# EAGLE design W681X (EAGLE 6.6.0)
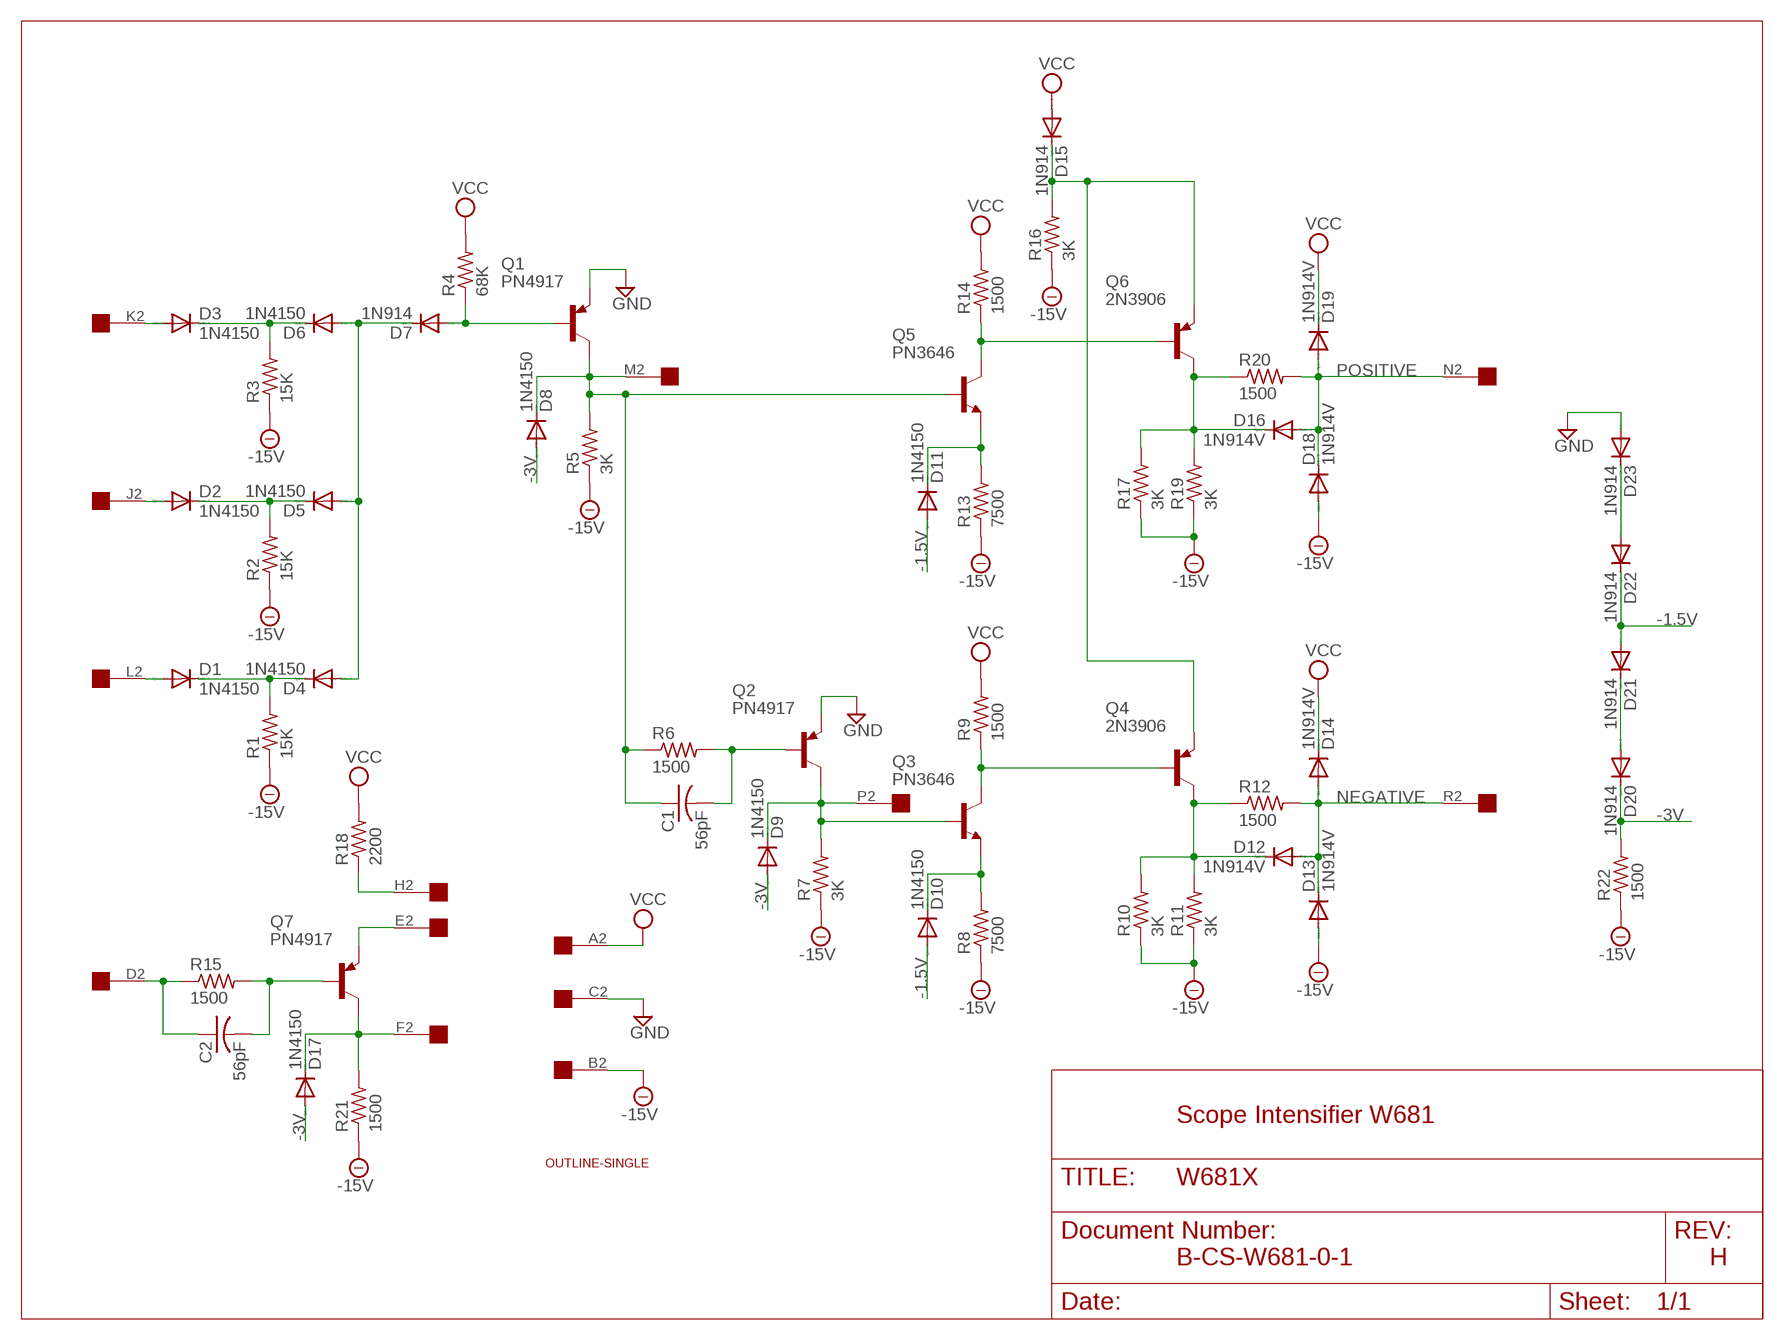
[diagram p0: schematic, sheet 1]

## Parts
C1  56pF  C-US  [C063-025X075]
C2  56pF  C-US  [C063-025X075]
D1  1N4150  DIODE-DO35-10  [DO35-10]
D2  1N4150  DIODE-DO35-10  [DO35-10]
D3  1N4150  DIODE-DO35-10  [DO35-10]
D4  1N4150  DIODE-DO35-10  [DO35-10]
D5  1N4150  DIODE-DO35-10  [DO35-10]
D6  1N4150  DIODE-DO35-10  [DO35-10]
D7  1N914  DIODE-DO35-10  [DO35-10]
D8  1N4150  DIODE-DO35-10  [DO35-10]
D9  1N4150  DIODE-DO35-10  [DO35-10]
D10  1N4150  DIODE-DO35-10  [DO35-10]
D11  1N4150  DIODE-DO35-10  [DO35-10]
D12  1N914V  DIODE-DO35-10  [DO35-10]
D13  1N914V  DIODE-DO35-10  [DO35-10]
D14  1N914V  DIODE-DO35-10  [DO35-10]
D15  1N914  DIODE-DO35-10  [DO35-10]
D16  1N914V  DIODE-DO35-10  [DO35-10]
D17  1N4150  DIODE-DO35-10  [DO35-10]
D18  1N914V  DIODE-DO35-10  [DO35-10]
D19  1N914V  DIODE-DO35-10  [DO35-10]
D20  1N914  DIODE-DO35-10  [DO35-10]
D21  1N914  DIODE-DO35-10  [DO35-10]
D22  1N914  DIODE-DO35-10  [DO35-10]
D23  1N914  DIODE-DO35-10  [DO35-10]
Q1  PN4917  -PNP-TO5  [TO5]
Q2  PN4917  -PNP-TO5  [TO5]
Q3  PN3646  -NPN-TO5  [TO5]
Q4  2N3906  -PNP-TO5  [TO5]
Q5  PN3646  -NPN-TO5  [TO5]
Q6  2N3906  -PNP-TO5  [TO5]
Q7  PN4917  -PNP-TO5  [TO5]
R1  15K  R-US_0207/10  [0207/10]
R2  15K  R-US_0207/10  [0207/10]
R3  15K  R-US_0207/10  [0207/10]
R4  68K  R-US_0207/10  [0207/10]
R5  3K  R-US_0207/10  [0207/10]
R6  1500  R-US_0207/10  [0207/10]
R7  3K  R-US_0207/10  [0207/10]
R8  7500  R-US_0207/10  [0207/10]
R9  1500  R-US_0207/10  [0207/10]
R10  3K  R-US_0207/10  [0207/10]
R11  3K  R-US_0207/10  [0207/10]
R12  1500  R-US_0207/10  [0207/10]
R13  7500  R-US_0207/10  [0207/10]
R14  1500  R-US_0207/10  [0207/10]
R15  1500  R-US_0207/10  [0207/10]
R16  3K  R-US_0207/10  [0207/10]
R17  3K  R-US_0207/10  [0207/10]
R18  2200  R-US_0207/10  [0207/10]
R19  3K  R-US_0207/10  [0207/10]
R20  1500  R-US_0207/10  [0207/10]
R21  1500  R-US_0207/10  [0207/10]
R22  1500  R-US_0207/10  [0207/10]
U$1  OUTLINE-SINGLE  [SINGLE]
U$2  EDGE-1  [EDGE-CON1]

## Nets
-1.5V [supply]: D10.A D11.A D21.A D22.C
-3V: D8.A D9.A D17.A D20.C R22.2
-15V [supply]: D13.A D18.A R1.1 R2.1 R3.1 R5.1 R7.1 R8.1 R10.1 R11.1 R13.1 R16.1 R17.1 R19.1 R21.1 R22.1 U$2.B2
GND [supply]: D23.A Q1.1(E) Q2.1(E) U$2.C2
N$1: D1.A U$2.L2
N$2: D2.A U$2.J2
N$3: D3.A U$2.K2
N$4: D1.C D4.C R1.2
N$5: D2.C D5.C R2.2
N$6: D3.C D6.C R3.2
N$7: D4.A D5.A D6.A D7.C
N$8: D7.A Q1.2(B) R4.1
N$9: C1.1 D8.C Q1.3(C) Q5.2(B) R5.2 R6.1 U$2.M2
N$10: C1.2 Q2.2(B) R6.2
N$11: D9.C Q2.3(C) Q3.2(B) R7.2 U$2.P2
N$12: Q3.3(C) Q4.2(B) R9.1
N$13: D10.C Q3.1(E) R8.2
N$14: D12.C Q4.3(C) R10.2 R11.2 R12.1
N$15: Q5.3(C) Q6.2(B) R14.1
N$16: D11.C Q5.1(E) R13.2
N$17: D15.C Q4.1(E) Q6.1(E) R16.2
N$18: D16.C Q6.3(C) R17.2 R19.2 R20.1
N$19: C2.1 R15.1 U$2.D2
N$20: C2.2 Q7.2(B) R15.2
N$21: D17.C Q7.3(C) R21.2 U$2.F2
N$22: Q7.1(E) U$2.E2
N$23: R18.1 U$2.H2
N$25: D20.A D21.C
N$26: D22.A D23.C
NEGATIVE: D12.A D13.C D14.A R12.2 U$2.R2
POSITIVE: D16.A D18.C D19.A R20.2 U$2.N2
VCC [supply]: D14.C D15.A D19.C R4.2 R9.2 R14.2 R18.2 U$2.A2
Unconnected: U$2.S2 U$2.T2 U$2.U2 U$2.V2

## Notes on the sheet
- Scope Intensifier W681
- B-CS-W681-0-1 | H

## Library data of the parts
C1 C2 = dec-con:C-US: Capacitors with funky DEC lead spacing.
D1-D23 = diode:DIODE-: DIODE
Q1 Q2 Q4 Q6 Q7 = transistor:*-PNP-: PNP Transistror
Q3 Q5 = transistor:*-NPN-: NPN Transistror BF959 corrected 2008.03.06
R1-R22 = rcl:R-US_: RESISTOR, American symbol
U$1 = dec-con:OUTLINE-*: Board outlines for DEC boards.
U$2 = dec-con:EDGE-1: Single-Sided DEC Edge Connector -- (side 2)

## Net classes
1 supply: width 0.813 mm

## Board
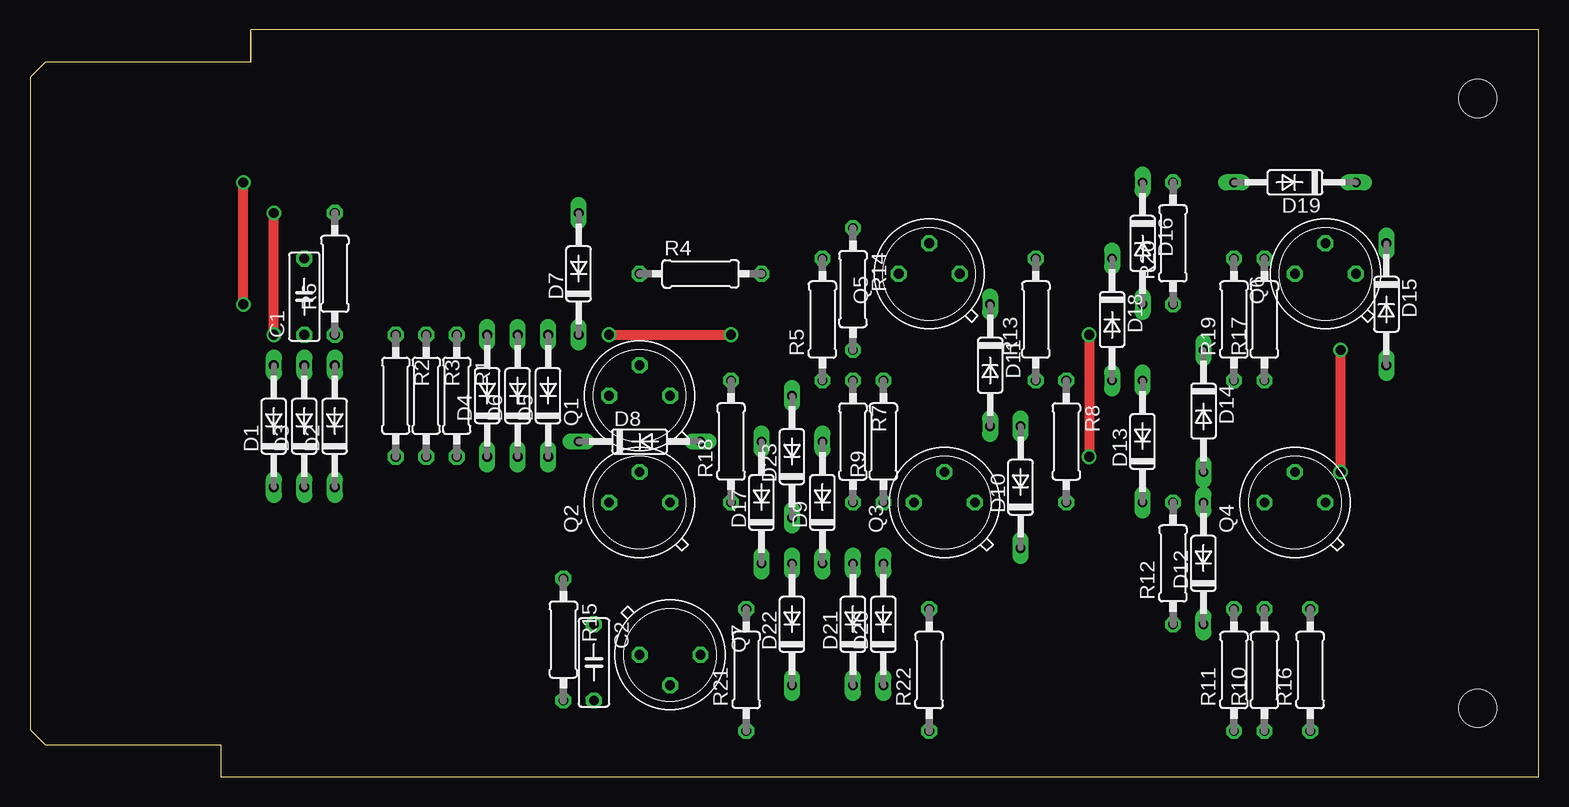
[diagram p1: board, top side]
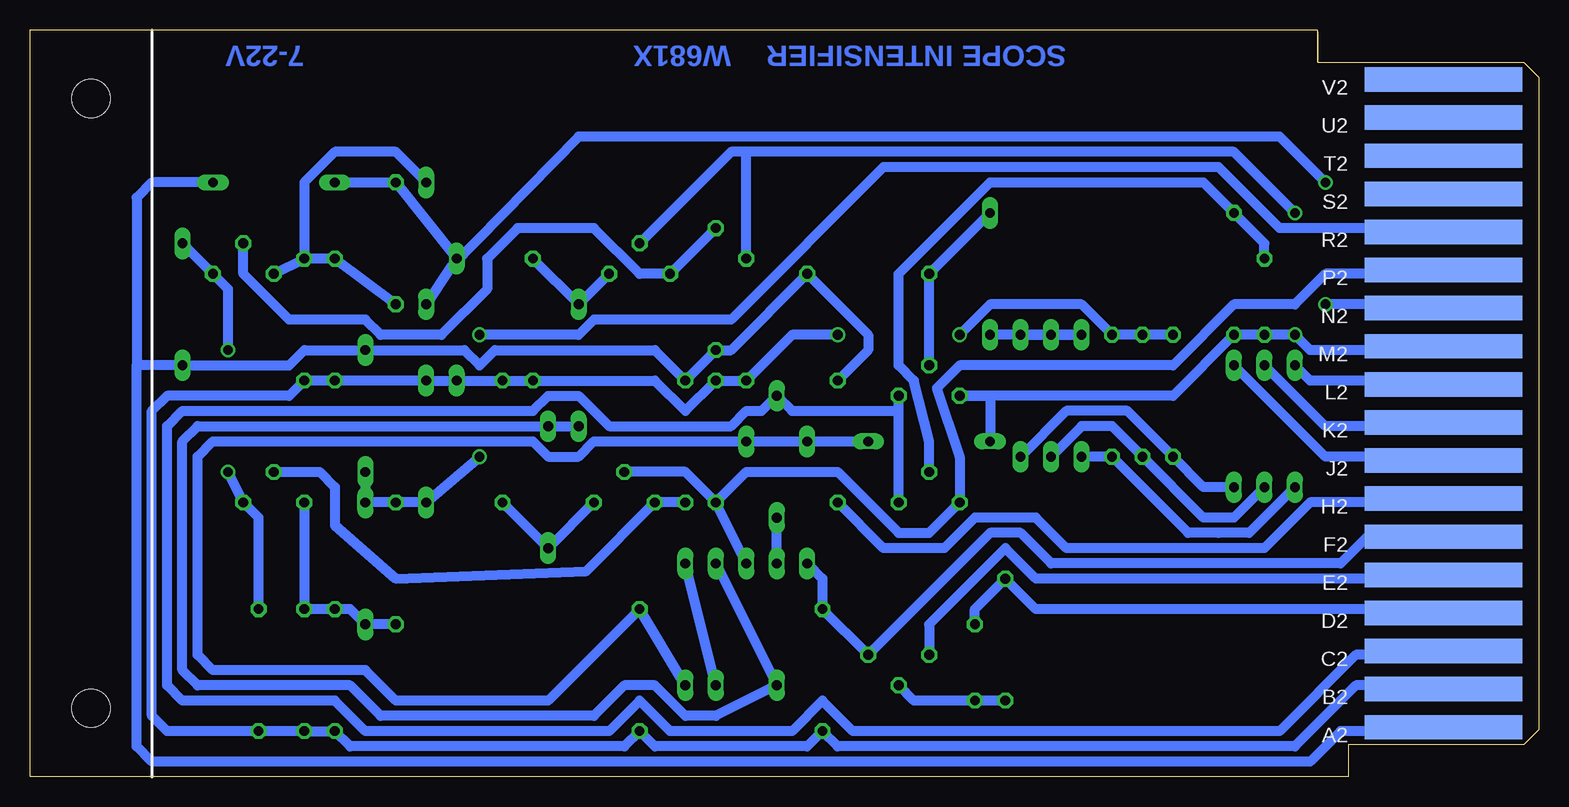
[diagram p2: board, bottom side, seen from below]

Size 125.73 x 62.23 mm. Coordinates in mm from the lower left corner, seen from the top.
Copper layers (1+16): Top 0.035mm / dielectric 1.5mm / Bottom 0.035mm
Design rules "16mils": minimum track width 16mil, minimum drill 32mil, track to track 15mil, track to pad 10mil, pad to pad 10mil, via to via 10mil, smd to smd 10mil, copper to edge 13mil, drill to drill 10mil, minimum pad ring 10mil, minimum via ring 8mil, stop-mask expansion 0mil, vias tented up to drill 0mil, thermal gap 10mil

### Footprints (pad centres in the part's own frame; a part is rotated, then mirrored left to right if it is on the bottom)
C063-025X075 = drill 0.813 octagon: 1 -2.54,0; 2 3.81,0
DO35-10 = drill 0.813 long: A 5.08,0; C -5.08,0
TO5 = drill 0.813 octagon: 1 0,-2.54; 2 2.54,0; 3 0,2.54
0207/10 = drill 0.813 octagon: 1 -5.08,0; 2 5.08,0
SINGLE = hole 3.175: 120.65,56.515; 120.65,5.715
EDGE-CON1 = smd 13.106 x 2.032 bottom: A2 7.938,4.128; B2 7.938,7.303; C2 7.938,10.477; D2 7.938,13.652; E2 7.938,16.828; F2 7.938,20.003; H2 7.938,23.177; J2 7.938,26.352; K2 7.938,29.527; L2 7.938,32.703; M2 7.938,35.877; N2 7.938,39.053; P2 7.938,42.227; R2 7.938,45.403; S2 7.938,48.578; T2 7.938,51.752; U2 7.938,54.928; V2 7.938,58.102

### Placement (x,y rotation side)
C1  22.86,39.37 90 top
C2  46.99,10.16 270 top
D1  20.32,29.21 90 top
D2  25.4,29.21 90 top
D3  22.86,29.21 90 top
D4  38.1,31.75 90 top
D5  43.18,31.75 90 top
D6  40.64,31.75 90 top
D7  45.72,41.91 90 top
D8  50.8,27.94 0 top
D9  66.04,22.86 90 top
D10  82.55,24.13 90 top
D11  80.01,34.29 270 top
D12  97.79,17.78 90 top
D13  92.71,27.94 90 top
D14  97.79,30.48 270 top
D15  113.03,39.37 270 top
D16  92.71,44.45 270 top
D17  60.96,22.86 90 top
D18  90.17,38.1 270 top
D19  105.41,49.53 180 top
D20  71.12,12.7 90 top
D21  68.58,12.7 90 top
D22  63.5,12.7 90 top
D23  63.5,26.67 90 top
Q1  50.8,31.75 90 top
Q2  50.8,22.86 90 top
Q3  76.2,22.86 90 top
Q4  105.41,22.86 90 top
Q5  74.93,41.91 90 top
Q6  107.95,41.91 90 top
Q7  53.34,10.16 270 top
R1  35.56,31.75 270 top
R2  30.48,31.75 270 top
R3  33.02,31.75 270 top
R4  55.88,41.91 0 top
R5  66.04,38.1 90 top
R6  25.4,41.91 90 top
R7  68.58,27.94 270 top
R8  86.36,27.94 270 top
R9  71.12,27.94 90 top
R10  102.87,8.89 90 top
R11  100.33,8.89 90 top
R12  95.25,17.78 90 top
R13  83.82,38.1 90 top
R14  68.58,40.64 270 top
R15  44.45,11.43 270 top
R16  106.68,8.89 90 top
R17  102.87,38.1 90 top
R18  58.42,27.94 90 top
R19  100.33,38.1 90 top
R20  95.25,44.45 90 top
R21  59.69,8.89 90 top
R22  74.93,8.89 90 top
U$1  0,0 0 top
U$2  0,0 0 top

### Tracks (layer width: path | path; a pad name or v marks a point on that pad's centre or on a via)
-1.5V
  Bottom 0.813: D21.A D22.C 68.58,5.08 71.12,5.08 73.66,7.62 76.2,7.62 78.74,5.08 96.52,5.08 99.06,7.62 111.76,7.62 113.03,8.89 113.03,27.94 111.76,29.21 D10.A D11.A
-3V
  Bottom 0.813: D20.C R22.2 82.55,6.35 95.25,6.35 97.79,8.89 110.49,8.89 111.76,10.16 111.76,26.67 110.49,27.94 83.82,27.94 82.55,26.67 80.01,26.67 78.74,27.94 D9.A D17.A D8.A
-15V  (via drill 0.81)
  Top 0.813: v48.26,36.83 v58.42,36.83
  Bottom 0.813: U$2.B2 8.89,7.62 15.24,7.62 20.32,2.54 58.42,2.54 R21.1 60.96,2.54 73.66,2.54 R22.1 76.2,2.54 99.06,2.54 R11.1 R10.1 R16.1 114.3,3.81 115.57,5.08 115.57,30.48 114.3,31.75 104.14,31.75 R17.1 R19.1 D13.A D18.A R8.1 R13.1 73.66,33.02 71.12,30.48 R7.1 R5.1 62.23,36.83 v58.42,36.83 | R2.1 R3.1 R1.1 38.1,39.37 45.72,39.37 v48.26,36.83
GND
  Bottom 0.813: U$2.C2 10.16,10.16 15.24,10.16 21.59,3.81 57.15,3.81 59.69,6.35 62.23,3.81 72.39,3.81 74.93,6.35 77.47,3.81 97.79,3.81 100.33,6.35 113.03,6.35 114.3,7.62 114.3,29.21 113.03,30.48 83.82,30.48 82.55,31.75 80.01,31.75 77.47,29.21 67.31,29.21 66.04,30.48 64.77,30.48 D23.A 62.23,30.48 53.34,30.48 Q1.1 Q2.1
N$1
  Bottom 0.813: U$2.L2 10.16,33.02 19.05,33.02 D1.A
N$2
  Bottom 0.813: U$2.J2 8.89,26.67 17.78,26.67 D2.A
N$3
  Bottom 0.813: U$2.K2 8.89,29.21 17.78,29.21 D3.A
N$4
  Bottom 0.813: D1.C 24.13,20.32 26.67,20.32 29.21,20.32 R1.2 D4.C
N$5
  Bottom 0.813: D2.C 27.94,24.13 R2.2 34.29,30.48 39.37,30.48 D5.C
N$6
  Bottom 0.813: D3.C 25.4,21.59 27.94,21.59 R3.2 35.56,29.21 38.1,29.21 D6.C
N$7
  Bottom 0.813: D5.A D6.A D4.A D7.C
N$8
  Bottom 0.813: Q1.2 R4.1 D7.A
N$9  (via drill 0.81)
  Top 0.813: v20.32,36.83 v20.32,46.99
  Bottom 0.813: U$2.M2 8.89,35.56 19.05,35.56 v20.32,36.83 C1.1 R6.1 30.48,31.75 Q1.3 45.72,31.75 D8.C | R5.2 66.04,52.07 | 66.04,52.07 67.31,52.07 Q5.2 | v20.32,46.99 25.4,52.07 66.04,52.07
N$10
  Bottom 0.813: Q2.2 50.8,27.94 52.07,33.02 53.34,34.29 53.34,41.91 45.72,49.53 27.94,49.53 R6.2 22.86,44.45 C1.2
N$11
  Bottom 0.813: U$2.P2 8.89,41.91 17.78,41.91 20.32,39.37 25.4,39.37 30.48,34.29 48.26,34.29 50.17,32.38 48.26,26.67 Q2.3 50.8,20.32 53.34,20.32 58.42,25.4 66.04,25.4 R7.2 | D9.C R7.2 | R7.2 71.12,25.4 Q3.2
N$12
  Bottom 0.813: R9.1 Q3.3 79.38,17.14 95.25,16.51 100.33,20.95 100.33,24.13 101.6,25.4 Q4.2
N$13
  Bottom 0.813: R8.2 D10.C Q3.1
N$14
  Bottom 0.813: R12.1 D12.C 99.06,13.97 R11.2 R10.2 Q4.3
N$15
  Bottom 0.813: R14.1 Q5.3 74.93,41.91 78.74,45.72 85.09,45.72 87.63,43.18 87.63,40.64 91.44,36.83 96.52,36.83 97.79,38.1 104.14,38.1 107.95,41.91 Q6.2
N$16
  Bottom 0.813: R13.2 D11.C Q5.1
N$17  (via drill 0.81)
  Top 0.813: v109.22,25.4 v109.22,35.56
  Bottom 0.813: R16.2 106.68,21.59 Q4.1 v109.22,25.4 | D15.C Q6.1 109.22,40.64 v109.22,35.56
N$18
  Bottom 0.813: R20.1 R19.2 R17.2 | Q6.3 R17.2 | D16.C 95.25,52.07 100.33,52.07 102.87,49.53 R17.2
N$19
  Bottom 0.813: U$2.D2 8.89,13.97 41.91,13.97 R15.1 46.99,13.97 C2.1
N$20
  Bottom 0.813: R15.2 C2.2 52.07,6.35 Q7.2
N$21
  Bottom 0.813: U$2.F2 8.89,20.32 13.97,20.32 16.51,17.78 40.64,17.78 43.18,20.32 45.72,20.32 Q7.3 R21.2 59.69,16.51 D17.C
N$22
  Bottom 0.813: U$2.E2 8.89,16.51 41.91,16.51 44.45,19.05 50.8,12.7 Q7.1
N$23
  Bottom 0.813: U$2.H2 8.89,22.86 19.05,22.86 22.86,19.05 39.37,19.05 41.91,21.59 46.99,21.59 49.53,19.05 54.61,19.05 R18.1
N$25
  Bottom 0.813: D21.C D20.A
N$26
  Bottom 0.813: D22.A D23.C
NEGATIVE  (via drill 0.81)
  Top 0.813: v88.27,36.83 v88.27,26.67
  Bottom 0.813: U$2.R2 8.89,45.72 21.59,45.72 26.67,50.8 54.61,50.8 67.31,38.1 78.74,38.1 80.01,36.83 v88.27,36.83 | D14.A D12.A R12.2 D13.C v88.27,26.67
POSITIVE  (via drill 0.81)
  Top 0.813: v17.78,39.37 v17.78,49.53
  Bottom 0.813: U$2.N2 8.89,39.37 v17.78,39.37 | D16.A 90.66,42.45 | 90.66,42.45 D18.C R20.2 D19.A | v17.78,49.53 21.59,53.34 80.01,53.34 90.66,42.45
VCC
  Bottom 0.813: U$2.A2 8.89,3.81 16.51,3.81 19.05,1.27 115.57,1.27 116.84,2.54 116.84,34.29 | R18.2 55.88,35.56 55.88,36.83 R4.2 67.31,35.56 R14.2 R9.2 73.66,35.56 87,35.56 88.27,34.29 89.54,35.56 D14.C 102.87,35.56 104.14,34.29 D15.A 116.84,34.29 | D19.C 115.57,49.53 116.84,48.26 116.84,34.29

### Text on the board
Bottom: SCOPE INTENSIFIER | W681X | 7-22V